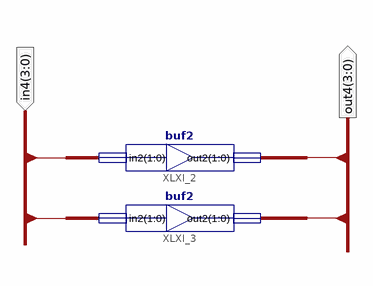
[diagram p0: schematic sheet 1]
// Xilinx ISE schematic buf4.sch (spartan6) as structural Verilog: 2 symbols, 2 ports
module buf4 (
  input  [3:0] in4,
  output [3:0] out4
);

  buf2 XLXI_2 (.in2(in4[3:2]), .out2(out4[3:2]));
  buf2 XLXI_3 (.in2(in4[1:0]), .out2(out4[1:0]));
endmodule
